# Altium project DARKYDEN.PrjPcb (part 15 of 15)

## Sheet USB2_0_Connector.SchDoc: DARKYDEN_USBC2_0_Connector
size Letter; ApprovedBy: APPROUVÉ PAR; Author: Harold Malbrouck; Organization: Cegep Limoilou; Address1: 1300, 8e Avenue; Address2: Québec, QC; Address3: Canada; Address4: G1J 5L5; Revision: Rev.C; SheetNumber: 21; SheetTotal: 22
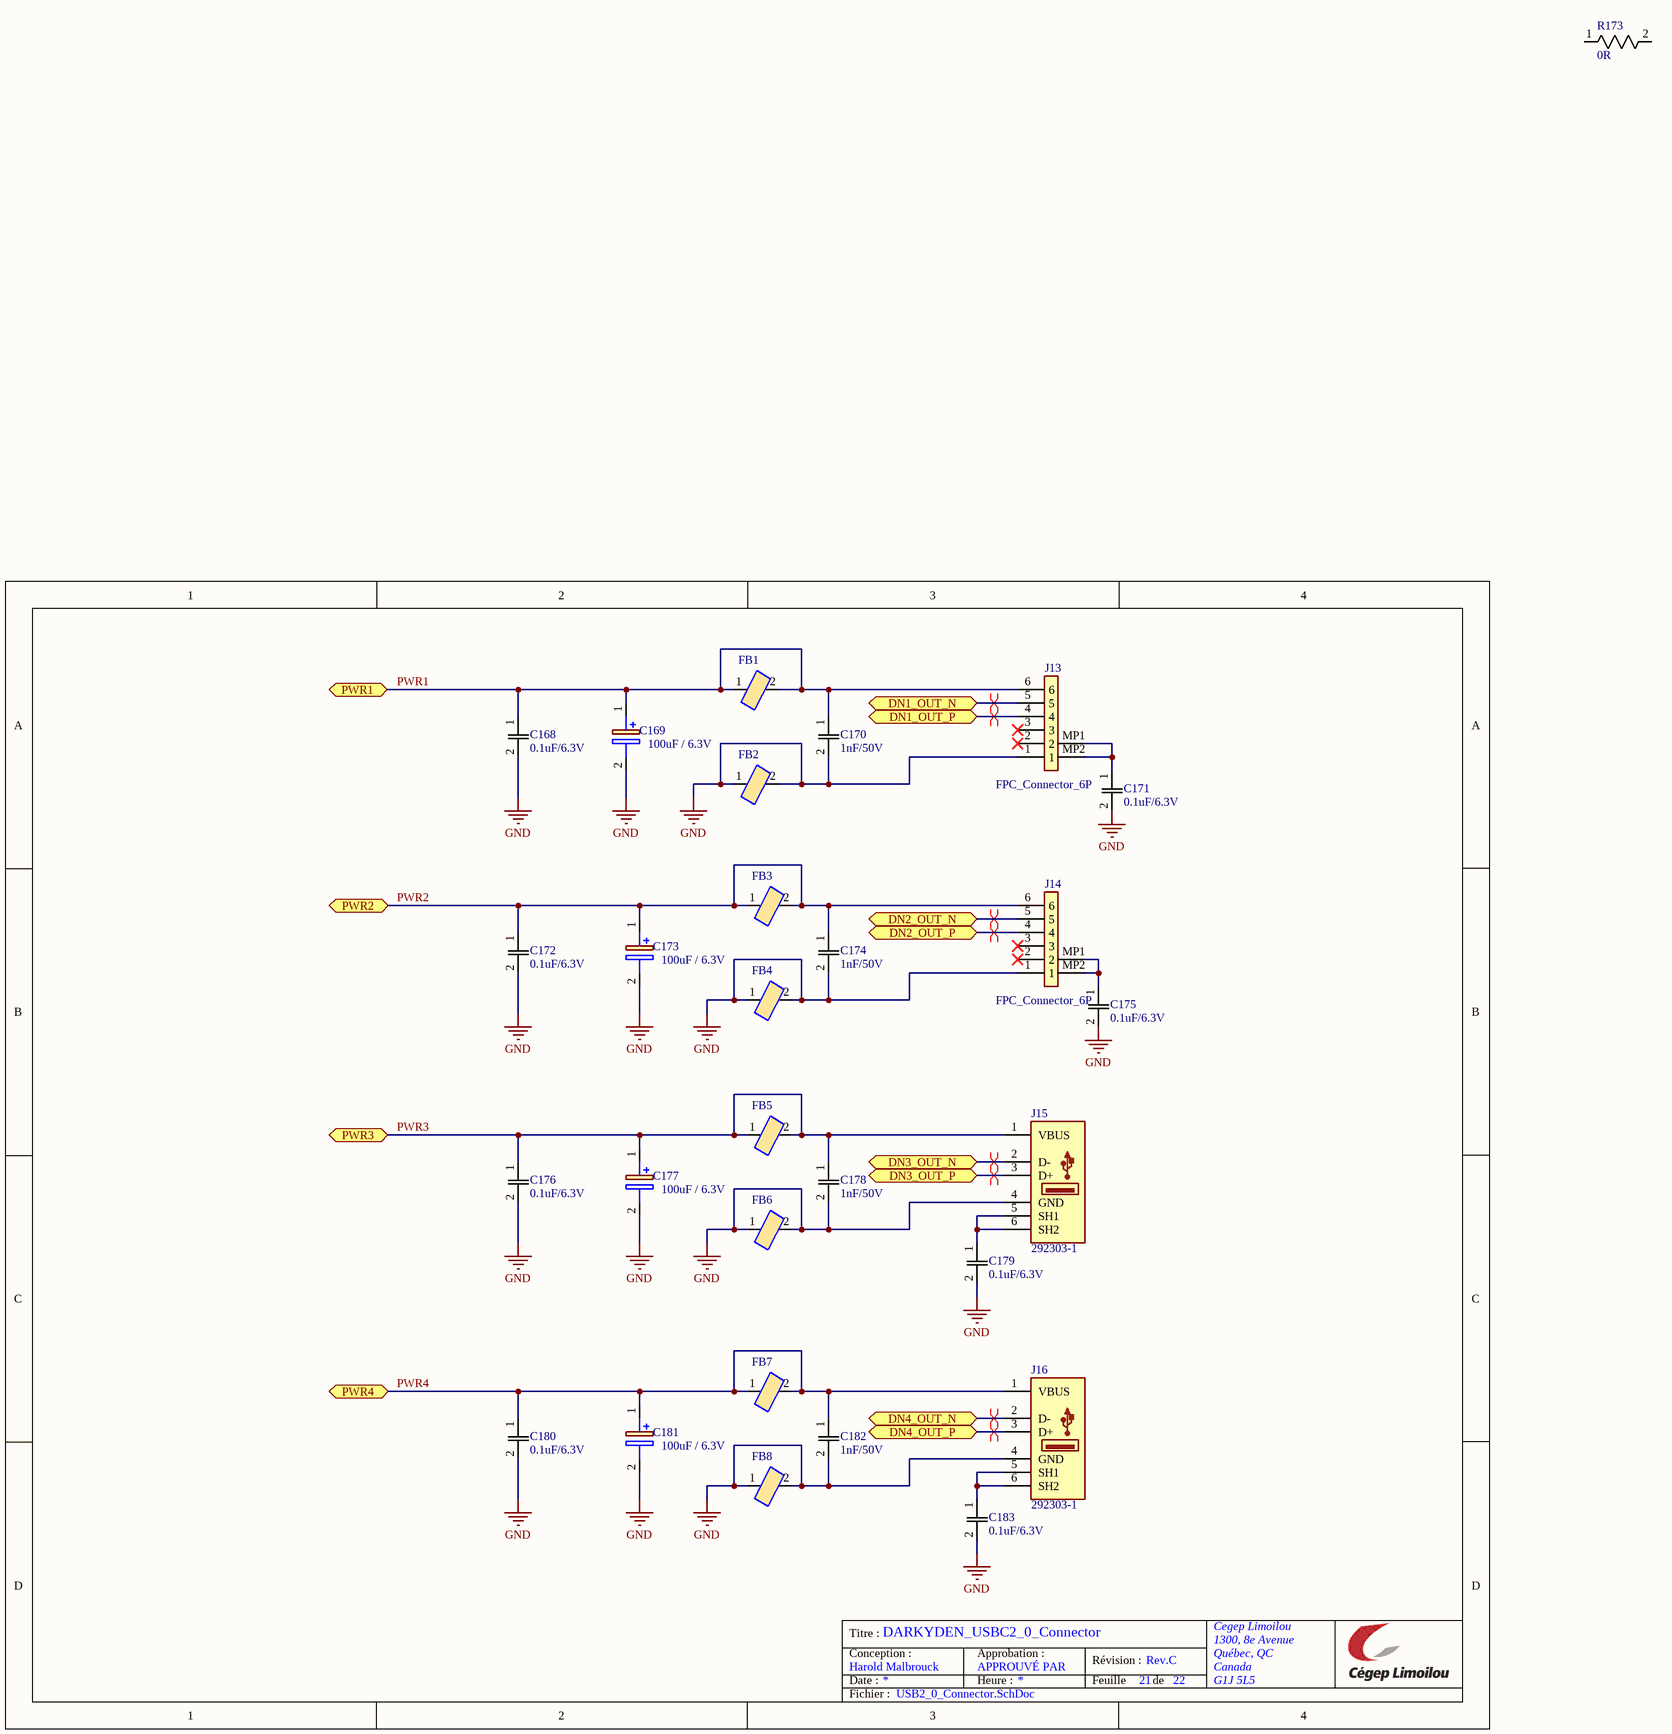
[diagram p20: USB2_0_Connector.SchDoc]

### Parts
C168  0.1uF/6.3V  [C0805]
C169  100uF / 6.3V  [EEE0GA101SR]
C170  1nF/50V  [CAPC2012X88N]
C171  0.1uF/6.3V  [C0805]
C172  0.1uF/6.3V  [C0805]
C173  100uF / 6.3V  [EEE0GA101SR]
C174  1nF/50V  [CAPC2012X88N]
C175  0.1uF/6.3V  [C0805]
C176  0.1uF/6.3V  [C0805]
C177  100uF / 6.3V  [EEE0GA101SR]
C178  1nF/50V  [CAPC2012X88N]
C179  0.1uF/6.3V  [C0805]
C180  0.1uF/6.3V  [C0805]
C181  100uF / 6.3V  [EEE0GA101SR]
C182  1nF/50V  [CAPC2012X88N]
C183  0.1uF/6.3V  [C0805]
FB1  220R / 100MHz  [BLM18SP221SN1B]  (value not drawn)
FB2  220R / 100MHz  [BLM18SP221SN1B]  (value not drawn)
FB3  220R / 100MHz  [BLM18SP221SN1B]  (value not drawn)
FB4  220R / 100MHz  [BLM18SP221SN1B]  (value not drawn)
FB5  220R / 100MHz  [BLM18SP221SN1B]  (value not drawn)
FB6  220R / 100MHz  [BLM18SP221SN1B]  (value not drawn)
FB7  220R / 100MHz  [BLM18SP221SN1B]  (value not drawn)
FB8  220R / 100MHz  [BLM18SP221SN1B]  (value not drawn)
J13  FPC_Connector_6P  [23287026]
J14  FPC_Connector_6P  [23287026]
J15  292303-1  [TECONN-4POS-USB]
J16  292303-1  [TECONN-4POS-USB]
R173  0R  [ERJ3EKF1000V]

### Ports
DN1_OUT_N (bidir, see USB2_0[3C]), DN1_OUT_P (bidir, see USB2_0[3C]), DN2_OUT_N (bidir, see USB2_0[4C]), DN2_OUT_P (bidir, see USB2_0[4C]), DN3_OUT_N (bidir, see USB2_0[2D]), DN3_OUT_P (bidir, see USB2_0[2D]), DN4_OUT_N (bidir, see USB2_0[3D]), DN4_OUT_P (bidir, see USB2_0[3D]), PWR1 (bidir, see USB2_0[2C]), PWR2 (bidir, see USB2_0[3C]), PWR3 (bidir, see USB2_0[1D]), PWR4 (bidir, see USB2_0[3D])

### Nets
GND: C168.2 C169.2(-) C170.2 C171.2 C172.2 C173.2(-) C174.2 C175.2 C176.2 C177.2(-) C178.2 C179.2 C180.2 C181.2(-) C182.2 C183.2 FB2.1 FB2.2 FB4.1 FB4.2 FB6.1 FB6.2 FB8.1 FB8.2 J13.1 J14.1 J15.4(GND) J16.4(GND)  [project net PACK-]
DN1_OUT_N: J13.5 ; port DN1_OUT_N
DN1_OUT_P: J13.4 ; port DN1_OUT_P
DN2_OUT_N: J14.5 ; port DN2_OUT_N
DN2_OUT_P: J14.4 ; port DN2_OUT_P
DN3_OUT_N: J15.2(D-) ; port DN3_OUT_N
DN3_OUT_P: J15.3(D+) ; port DN3_OUT_P
DN4_OUT_N: J16.2(D-) ; port DN4_OUT_N
DN4_OUT_P: J16.3(D+) ; port DN4_OUT_P
PWR1: C168.1 C169.1(+) C170.1 FB1.1 FB1.2 J13.6 ; port PWR1
PWR2: C172.1 C173.1(+) C174.1 FB3.1 FB3.2 J14.6 ; port PWR2
PWR3: C176.1 C177.1(+) C178.1 FB5.1 FB5.2 J15.1(VBUS) ; port PWR3
PWR4: C180.1 C181.1(+) C182.1 FB7.1 FB7.2 J16.1(VBUS) ; port PWR4
NetC171_1: C171.1 J13.MP1 J13.MP2
NetC175_1: C175.1 J14.MP1 J14.MP2
NetC179_1: C179.1 J15.5(SH1) J15.6(SH2)
NetC183_1: C183.1 J16.5(SH1) J16.6(SH2)

Not connected (* = marked no-connect by the designer): J13 2* 3*; J14 2* 3*; R173 1 2

### Layout directives
differential pair: DN1_OUT_N, DN1_OUT_P, DN2_OUT_N, DN2_OUT_P, DN3_OUT_N, DN3_OUT_P, DN4_OUT_N, DN4_OUT_P

### Notes on the sheet
- Titre :
- Conception :
- Date :
- Approbation :
- Heure :
- Révision :
- Feuille
- de
- Fichier :

### Library data of the parts
C168 C171 C172 C175 C176 C179 C180 C183 = C0805C104K9RACTU: 0.1uF 6.3V X7R 10% Pad SMD 0805 125C T/R; Manufacturer_Name: KEMET; Dielectric Material: Ceramic; Material: 4241ConductorMaterial; Value: 100nF; Datasheet Link: https://content.kemet.com/datasheets/KEM_C1002_X7R_SMD.pdf; Height: 1.1mm; Manufacturer_Part_Number: C0805C104K9RACTU; Mouser Part Number: 80-C0805C104K9R; Mouser Price/Stock: https://www.mouser.co.uk/ProductDetail/KEMET/C0805C104K9RACTU?qs=jbCUrP3sAgRYLjBU7s5h8Q%3D%3D; Arrow Part Number: C0805C104K9RACTU; Arrow Price/Stock: https://www.arrow.com/en/products/c0805c104k9ractu/kemet-corporation; Supplier: Digikey; Supplier Part Number: 399-C0805C104K9RACTUCT-ND; Manufacturer: KEMET; Manufacturer Part Number: C0805C104K9RACTU; RoHS: Yes; Category: Ceramic Capacitors; Stock: 68008; Pricing: 1=0.21, 10=0.214, 100=0.1506, 1000=0.11154 (USD); Mounting Technology: Surface Mount; Case/Package: 0805; Case Code (Metric): 2012; Case Code (Imperial): 0805; Min Operating Temperature: -55°C; Max Operating Temperature: 125°C; Package Quantity: 4000; Voltage Rating: 6.3V; Tolerance: 10%; Packaging: Tape and Reel; Voltage Rating (DC): 6.3V; Dielectric: X7R; Termination: SMD/SMT; Series: SMD Comm X7R; Construction: Flat; Length: 2mm; Width: 1.2mm; Thickness: 0.039inch; Depth: 1.25mm; Radiation Hardening: No; RoHS Compliant: Yes; ComponentLink1URL: http://www.farnell.com/datasheets/2746329.pdf?src-supplier=Farnell; ComponentLink1Description: http://www.farnell.com/datasheets/2746329.pdf?src-supplier=Farnell; ComponentLink2URL: http://www.mouser.com/ds/2/212/KEM_C1002_X7R_SMD-1102033.pdf?src-supplier=Mouser; ComponentLink2Description: http://www.mouser.com/ds/2/212/KEM_C1002_X7R_SMD-1102033.pdf?src-supplier=Mouser; ComponentLink3URL: http://datasheet.octopart.com/C0805C104K9RACTU-KEMET-datasheet-157246124.pdf?src-supplier=Avnet; ComponentLink3Description: http://datasheet.octopart.com/C0805C104K9RACTU-KEMET-datasheet-157246124.pdf?src-supplier=Avnet; ComponentLink4URL: http://datasheet.octopart.com/C0805C104K9RACTU-KEMET-datasheet-157246124.pdf?src-supplier=Onlinecomponents.com; ComponentLink4Description: http://datasheet.octopart.com/C0805C104K9RACTU-KEMET-datasheet-157246124.pdf?src-supplier=Onlinecomponents.com; ComponentLink5URL: http://capacitoredge.kemet.com/capedge2/DataSheet?pn=C0805C104K9RACTU&src-supplier=Avnet; ComponentLink5Description: http://capacitoredge.kemet.com/capedge2/DataSheet?pn=C0805C104K9RACTU&src-supplier=Avnet; ComponentLink6URL: http://www.farnell.com/datasheets/2746329.pdf?src-supplier=Newark; ComponentLink6Description: http://www.farnell.com/datasheets/2746329.pdf?src-supplier=Newark; ComponentLink7URL: http://datasheet.octopart.com/C0805C104K9RACTU-KEMET-datasheet-157246124.pdf?src-supplier=Digikey; ComponentLink7Description: http://datasheet.octopart.com/C0805C104K9RACTU-KEMET-datasheet-157246124.pdf?src-supplier=Digikey; ComponentLink8URL: https://api.kemet.com/component-edge/download/datasheet/C0805C104K9RACTU.pdf?src-supplier=Digikey; ComponentLink8Description: https://api.kemet.com/component-edge/download/datasheet/C0805C104K9RACTU.pdf?src-supplier=Digikey; ComponentLink9URL: https://datasheet.octopart.com/C0805C104K9RACTU.-KEMET-datasheet-179056791.pdf?src-supplier=Element14; ComponentLink9Description: https://datasheet.octopart.com/C0805C104K9RACTU.-KEMET-datasheet-179056791.pdf?src-supplier=Element14; ComponentLink10URL: https://datasheet.octopart.com/C0805C104K9RACTU-KEMET-datasheet-137357759.pdf?src-supplier=Farnell; ComponentLink10Description: https://datasheet.octopart.com/C0805C104K9RACTU-KEMET-datasheet-137357759.pdf?src-supplier=Farnell; ComponentLink11URL: http://www.farnell.com/datasheets/2746329.pdf?src-supplier=Element14; ComponentLink11Description: http://www.farnell.com/datasheets/2746329.pdf?src-supplier=Element14; ComponentLink12URL: https://datasheet.octopart.com/C0805C104K9RACTU-KEMET-datasheet-157246124.pdf?src-supplier=TME; ComponentLink12Description: https://datasheet.octopart.com/C0805C104K9RACTU-KEMET-datasheet-157246124.pdf?src-supplier=TME; ComponentLink13URL: http://datasheet.octopart.com/C0805C104K9RACTU-KEMET-datasheet-157246124.pdf?src-supplier=TTI; ComponentLink13Description: http://datasheet.octopart.com/C0805C104K9RACTU-KEMET-datasheet-157246124.pdf?src-supplier=TTI; ComponentLink14URL: http://datasheet.octopart.com/C0805C104K9RACTU-KEMET-datasheet-157246124.pdf?src-supplier=Electro+Sonic; ComponentLink14Description: http://datasheet.octopart.com/C0805C104K9RACTU-KEMET-datasheet-157246124.pdf?src-supplier=Electro+Sonic
C169 C173 C177 C181 = EEE-FPJ101UAR: 100uF 6.3V 20% Cap Aluminum Lytic  SMD 0.36 Ohm 240mA 2000h 105C Automotive T/R; Manufacturer_Name: Panasonic; Material: Aluminium; ESR (Equivalent Series Resistance): 360mR; Life (Hours): 2000Hour; Leakage Current: 6.3uA; Datasheet Link: http://industrial.panasonic.com/cdbs/www-data/pdf/RDE0000/ABA0000C1184.pdf; Height: 6.5mm; Manufacturer_Part_Number: EEE-FPJ101UAR; Mouser Part Number: 667-EEE-FPJ101UAR; Mouser Price/Stock: https://www.mouser.co.uk/ProductDetail/Panasonic/EEE-FPJ101UAR?qs=d1CqaRUMZD%252BxJy4M83vA9g%3D%3D; Arrow Part Number: EEE-FPJ101UAR; Arrow Price/Stock: https://www.arrow.com/en/products/eee-fpj101uar/panasonic?utm_currency=USD&region=europe; Supplier: Digikey; Supplier Part Number: PCE4514CT-ND; Manufacturer: Panasonic; Manufacturer Part Number: EEE-FPJ101UAR; RoHS: Yes; Category: Aluminum Electrolytic Capacitors; Stock: 28785; Pricing: 1=0.56, 10=0.35, 50=0.2602, 100=0.2317, 500=0.18256 (USD); Mounting Technology: Surface Mount,PCB; Case/Package: Radial; Dielectric Material: Aluminium; Min Operating Temperature: -55°C; Max Operating Temperature: 105°C; Value: 100uF; Packaging: Tape and Reel; Voltage Rating (DC): 6.3V; Package Quantity: 1; Termination: SMD/SMT; Series: FP; Ripple Current: 240mA; Tolerance: 20%; Voltage Rating: 6.3V; Ripple Current (AC): 240mA; Voltage: 6.3V; Construction: Cylindrical; Diameter: 5mm; Length: 6.1mm; Lead Pitch: 1.5mm; Height - Seated (Max): 0.228inch; Radiation Hardening: No; Lead Free: Lead Free; RoHS Compliant: Yes; Reach SVHC Compliant: Unknown; ComponentLink1URL: https://datasheet.ciiva.com/11777/0900766b80df09a1-11777260.pdf?src-supplier=Rs; ComponentLink1Description: https://datasheet.ciiva.com/11777/0900766b80df09a1-11777260.pdf?src-supplier=Rs; ComponentLink2URL: https://datasheet.ciiva.com/25614/0900766b80df09a1-25614042.pdf?src-supplier=Rs; ComponentLink2Description: https://datasheet.ciiva.com/25614/0900766b80df09a1-25614042.pdf?src-supplier=Rs; ComponentLink3URL: https://datasheet.ciiva.com/2985/aba0000ce114-2985560.pdf?src-supplier=Avnet; ComponentLink3Description: https://datasheet.ciiva.com/2985/aba0000ce114-2985560.pdf?src-supplier=Avnet; ComponentLink4URL: https://datasheet.ciiva.com/30259/aba0000ce114-30259452.pdf?src-supplier=Onlinecomponents.com; ComponentLink4Description: https://datasheet.ciiva.com/30259/aba0000ce114-30259452.pdf?src-supplier=Onlinecomponents.com; ComponentLink5URL: https://datasheet.ciiva.com/14597/70068195-14597061.pdf?src-supplier=Allied+Electronics; ComponentLink5Description: https://datasheet.ciiva.com/14597/70068195-14597061.pdf?src-supplier=Allied+Electronics; ComponentLink6URL: https://datasheet.ciiva.com/14606/70068195-14606383.pdf?src-supplier=Allied+Electronics; ComponentLink6Description: https://datasheet.ciiva.com/14606/70068195-14606383.pdf?src-supplier=Allied+Electronics; ComponentLink7URL: https://datasheet.ciiva.com/48523/fp-eng-tds-48523719.pdf?src-supplier=Distrelec; ComponentLink7Description: https://datasheet.ciiva.com/48523/fp-eng-tds-48523719.pdf?src-supplier=Distrelec; ComponentLink8URL: https://datasheet.ciiva.com/46391/370232-46391160.pdf?src-supplier=Element14; ComponentLink8Description: https://datasheet.ciiva.com/46391/370232-46391160.pdf?src-supplier=Element14; ComponentLink9URL: https://datasheet.ciiva.com/46398/370232-46398005.pdf?src-supplier=Element14; ComponentLink9Description: https://datasheet.ciiva.com/46398/370232-46398005.pdf?src-supplier=Element14
C170 C174 C178 C182 = C0805C102K5RAC-TU: 1000 pF ±10% 50V Ceramic Capacitor X7R 0805 (2012 Metric); Manufacturer_Name: KEMET; Datasheet Link: https://componentsearchengine.com/Datasheets/2/C0805C102K5RAC-TU.pdf; Height: 0.88mm; Manufacturer_Part_Number: C0805C102K5RAC-TU
FB1-FB8 = BLM18EG221SN1D: Ferrite Beads Multi-Layer 220Ohm 25% 100MHz 2A 50mOhm DCR 0603 Paper T/R; Manufacturer_Name: Murata Electronics; Manufacturer: Murata; Material: Steel,Ferrite; Value: 50mR; Number of Lines: 1; Number of Circuits: 1NUMBER; Datasheet Link: http://www.murata.com/~/media/webrenewal/support/library/catalog/products/emc/emifil/c31e.ashx?la=en-gb; Height: 0.95mm; Manufacturer_Part_Number: BLM18EG221SN1D; Mouser Part Number: 81-BLM18EG221SN1D; Mouser Price/Stock: https://www.mouser.co.uk/ProductDetail/Murata-Electronics/BLM18EG221SN1D?qs=uSeJpk%2F8In2DDeSj2a4KGA%3D%3D; Arrow Part Number: BLM18EG221SN1D; Arrow Price/Stock: https://www.arrow.com/en/products/blm18eg221sn1d/murata-manufacturing?utm_currency=USD&region=nac; Supplier: Digikey; Supplier Part Number: 490-3992-1-ND; Manufacturer Part Number: BLM18EG221SN1D; RoHS: Yes; Category: Ferrite Beads and Chips; Stock: 133283; Pricing: 1=0.24, 10=0.167, 25=0.1444, 50=0.1292, 100=0.1154, 250=0.09864, 500=0.08708, 1000=0.07636 (USD); Case/Package: 0603; Pins: 2; Core Material: Ferrite; Case Code (Metric): 1608; Case Code (Imperial): 0603; Min Operating Temperature: -55°C; Max Operating Temperature: 125°C; Tolerance: 25%; Impedance: 220R; Package Quantity: 1; Packaging: Tape and Reel; Current Rating: 2A; Max Current Rating: 2A; DC Resistance (DCR): 50mR; Max DC Current: 2A; Termination: SMD/SMT; Test Frequency: 100MHz; DC Current: 2A; Series: BLM18E; DC Resistance-Max: 50mR; RMS Current (Irms): 2A; ESR: 50mR; Frequency: 100MHz; Length: 1.6mm; Width: 0.8mm; Depth: 0.8mm; Radiation Hardening: No; Reach SVHC Compliant: No; Military Standard: Not; Lead Free: Lead Free; RoHS Compliant: Yes; ComponentLink1URL: https://datasheet.ciiva.com/11799/0900766b811b5866-11799010.pdf?src-supplier=Rs; ComponentLink1Description: https://datasheet.ciiva.com/11799/0900766b811b5866-11799010.pdf?src-supplier=Rs; ComponentLink2URL: https://datasheet.ciiva.com/41449/001171699-da-01-en-chip-drossel0603-220r-2000ma-1-6x0-8mm-41449376.pdf?src-supplier=Conrad; ComponentLink2Description: https://datasheet.ciiva.com/41449/001171699-da-01-en-chip-drossel0603-220r-2000ma-1-6x0-8mm-41449376.pdf?src-supplier=Conrad; ComponentLink3URL: https://datasheet.ciiva.com/41449/001172265-da-01-en-drossel-0603-220r-1-6x0-8mm-4000st-41449579.pdf?src-supplier=Conrad; ComponentLink3Description: https://datasheet.ciiva.com/41449/001172265-da-01-en-drossel-0603-220r-1-6x0-8mm-4000st-41449579.pdf?src-supplier=Conrad; ComponentLink4URL: https://datasheet.ciiva.com/1012/l0110s0101blm18e-1012872.pdf?src-supplier=Digikey; ComponentLink4Description: https://datasheet.ciiva.com/1012/l0110s0101blm18e-1012872.pdf?src-supplier=Digikey; ComponentLink5URL: https://datasheet.ciiva.com/1012/l0110s0101blm18e-1012873.pdf?src-supplier=Digikey; ComponentLink5Description: https://datasheet.ciiva.com/1012/l0110s0101blm18e-1012873.pdf?src-supplier=Digikey; ComponentLink6URL: https://datasheet.ciiva.com/1012/l0110s0101blm18e-1012874.pdf?src-supplier=Digikey; ComponentLink6Description: https://datasheet.ciiva.com/1012/l0110s0101blm18e-1012874.pdf?src-supplier=Digikey; ComponentLink7URL: https://datasheet.ciiva.com/14122/blm-series-eng-tds-14122908.pdf?src-supplier=Distrelec; ComponentLink7Description: https://datasheet.ciiva.com/14122/blm-series-eng-tds-14122908.pdf?src-supplier=Distrelec; ComponentLink8URL: https://datasheet.ciiva.com/1467/5169-1467157.pdf?src-supplier=Element14; ComponentLink8Description: https://datasheet.ciiva.com/1467/5169-1467157.pdf?src-supplier=Element14; ComponentLink9URL: https://datasheet.ciiva.com/1467/5169-1467158.pdf?src-supplier=Element14; ComponentLink9Description: https://datasheet.ciiva.com/1467/5169-1467158.pdf?src-supplier=Element14; ComponentLink10URL: https://datasheet.ciiva.com/8510/l0110s0101blm18e-8510140.pdf?src-supplier=Avnet; ComponentLink10Description: https://datasheet.ciiva.com/8510/l0110s0101blm18e-8510140.pdf?src-supplier=Avnet; ComponentLink11URL: https://datasheet.ciiva.com/16419/l0110s0101blm18e-16419148.pdf?src-supplier=Future+Electronics; ComponentLink11Description: https://datasheet.ciiva.com/16419/l0110s0101blm18e-16419148.pdf?src-supplier=Future+Electronics
J13 J14 = 2328702-6: FPC Connector; 0.5mm pitch dual contact back flip FPC, 6pos | TE Connectivity 2328702-6; Actuator Material: Thermoplastic; Actuator Color: Black; Number of Positions: 6; Voltage Rating: 50V; Current Rating: 500mA; Value: 7.6pF; Datasheet Link: https://www.te.com/commerce/DocumentDelivery/DDEController?Action=srchrtrv&DocNm=1-1773959-7-FPC-Connectors-CN&DocType=Data%20Sheet&DocLang=Chinese (Simplified)&PartCntxt=2328702-6&DocFormat=pdf; Height: 1.1mm; Manufacturer_Name: TE Connectivity; Manufacturer_Part_Number: 2328702-6; Mouser Part Number: 571-2328702-6; Mouser Price/Stock: https://www.mouser.co.uk/ProductDetail/TE-Connectivity/2328702-6?qs=w%2Fv1CP2dgqrAQsCHQ2ClBQ%3D%3D; Arrow Part Number: 2328702-6; Arrow Price/Stock: https://www.arrow.com/en/products/2328702-6/te-connectivity?utm_currency=USD&region=nac; Supplier: Digikey; Supplier Part Number: A141388CT-ND; Manufacturer: TE Connectivity; Manufacturer Part Number: 2328702-6; RoHS: Yes; Category: FFC / FPC; Stock: 48490; Pricing: 1=0.19, 10=0.162, 25=0.1512, 50=0.144, 100=0.1372, 250=0.12856, 500=0.12242, 1000=0.11657 (USD); Mounting Technology: Surface Mount; Case/Package: 0402; Contact Material: Copper Alloy; Contact Plating: Gold; Housing Material: Thermoplastic; Housing Color: Natural; Min Operating Temperature: -40°C; Max Operating Temperature: 85°C; Packaging: Cut Tape; Termination: Solder; Series: -; Ratings: AEC-Q200; Flammability Rating: UL94 V-0; ComponentLink1URL: https://www.te.com/commerce/DocumentDelivery/DDEController?Action=srchrtrv&amp;DocNm=2328702&amp;DocType=Customer+Drawing&amp;DocLang=English&src-supplier=Digikey; ComponentLink1Description: https://www.te.com/commerce/DocumentDelivery/DDEController?Action=srchrtrv&amp;DocNm=2328702&amp;DocType=Customer+Drawing&amp;DocLang=English&src-supplier=Digikey; ComponentLink2URL: https://www.te.com/commerce/DocumentDelivery/DDEController?Action=srchrtrv&DocNm=2328702&DocType=Customer+Drawing&DocLang=English&src-supplier=Digikey; ComponentLink2Description: https://www.te.com/commerce/DocumentDelivery/DDEController?Action=srchrtrv&DocNm=2328702&DocType=Customer+Drawing&DocLang=English&src-supplier=Digikey; ComponentLink3URL: https://datasheet.octopart.com/2328702-6-TE-Connectivity-datasheet-137167967.pdf?src-supplier=Electro+Sonic; ComponentLink3Description: https://datasheet.octopart.com/2328702-6-TE-Connectivity-datasheet-137167967.pdf?src-supplier=Electro+Sonic
J15 J16 = 292303-1: USB-A (USB TYPE-A) USB 2.0 Receptacle Connector 4 Position Through Hole, Right Angle; Manufacturer_Name: TE Connectivity; Datasheet Link: https://datasheet.datasheetarchive.com/originals/distributors/Datasheets_SAMA/3e4c4de204b167d1a9250e6de251b7b8.pdf; Manufacturer_Part_Number: 292303-1; Mouser Part Number: 571-292303-1; Mouser Price/Stock: https://www.mouser.co.uk/ProductDetail/TE-Connectivity/292303-1?qs=G%2F5vCLrg9vx2OsUPTgR%2F%252BQ%3D%3D; Arrow Part Number: 292303-1; Arrow Price/Stock: https://www.arrow.com/en/products/292303-1/te-connectivity?region=europe
R173 = ERJ-3GEY0R00V: Zero Ohm Resistor, Jumper, 0603 [1608 Metric], Thick Film, 100 mW, 1 A, Surface Mount; Manufacturer_Name: Panasonic; Power Rating: 100mW; Voltage Rating: 75V; Tolerance: 0%; Temperature Coefficient: 200ppm/°C; Datasheet Link: http://docs-europe.electrocomponents.com/webdocs/13ba/0900766b813ba21b.pdf; Height: 0.55mm; Manufacturer_Part_Number: ERJ-3GEY0R00V; Mouser Part Number: 667-ERJ-3GEY0R00V; Mouser Price/Stock: https://www.mouser.co.uk/ProductDetail/Panasonic/ERJ-3GEY0R00V?qs=66DK8nO8gJALIOqOWgiVwg%3D%3D; Arrow Part Number: ERJ-3GEY0R00V; Arrow Price/Stock: https://www.arrow.com/en/products/erj3gey0r00v/panasonic?region=europe; Supplier: Digikey; Supplier Part Number: P0.0GCT-ND; Manufacturer: Panasonic; Manufacturer Part Number: ERJ-3GEY0R00V; RoHS: Yes; Category: Chip SMD Resistors; Stock: 766631; Pricing: 1=0.1, 10=0.02, 25=0.0164, 50=0.0144, 100=0.0126, 250=0.0106, 500=0.00936, 1000=0.0083 (USD); Mounting Technology: Surface Mount; Case/Package: 0603; Case Code (Metric): 1608; Case Code (Imperial): 0603; Contact Plating: Tin; Min Operating Temperature: -55°C; Max Operating Temperature: 155°C; Packaging: Tape and Reel; Package Quantity: 5000; Value: 0R; Resistor Type: Thick Film; Number of Terminations: 2; Termination: SMD/SMT; Max Power Dissipation: 100mW; Features: Automotive AEC-Q200; Series: ERJ; Construction: Rectangular; Technology: THICK FILM; Length: 1.6mm; Width: 0.8mm; Depth: 0.8mm; Ratings: AEC-Q200; Radiation Hardening: No; Reach SVHC Compliant: No; Military Standard: Not; RoHS Compliant: Yes; Lead Free: 5697LeadFree; ComponentLink1URL: https://datasheet.ciiva.com/11808/0900766b80f806dd-11808207.pdf?src-supplier=Rs; ComponentLink1Description: https://datasheet.ciiva.com/11808/0900766b80f806dd-11808207.pdf?src-supplier=Rs; ComponentLink2URL: https://datasheet.ciiva.com/27055/1935748-27055113.pdf?src-supplier=Jameco; ComponentLink2Description: https://datasheet.ciiva.com/27055/1935748-27055113.pdf?src-supplier=Jameco; ComponentLink3URL: https://datasheet.ciiva.com/5959/1678796-5959707.pdf?src-supplier=Farnell; ComponentLink3Description: https://datasheet.ciiva.com/5959/1678796-5959707.pdf?src-supplier=Farnell; ComponentLink4URL: https://datasheet.ciiva.com/43460/1678796-43460647.pdf?src-supplier=Farnell; ComponentLink4Description: https://datasheet.ciiva.com/43460/1678796-43460647.pdf?src-supplier=Farnell; ComponentLink5URL: https://datasheet.ciiva.com/48532/aoa0000ce1-48532165.pdf?src-supplier=Avnet; ComponentLink5Description: https://datasheet.ciiva.com/48532/aoa0000ce1-48532165.pdf?src-supplier=Avnet; ComponentLink6URL: https://datasheet.ciiva.com/28695/1678796-28695833.pdf?src-supplier=Element14; ComponentLink6Description: https://datasheet.ciiva.com/28695/1678796-28695833.pdf?src-supplier=Element14; ComponentLink7URL: https://datasheet.ciiva.com/16834/aoa0000ce1-16834828.pdf?src-supplier=Future+Electronics; ComponentLink7Description: https://datasheet.ciiva.com/16834/aoa0000ce1-16834828.pdf?src-supplier=Future+Electronics; ComponentLink8URL: https://datasheet.ciiva.com/16758/70255313-16758527.pdf?src-supplier=Allied+Electronics; ComponentLink8Description: https://datasheet.ciiva.com/16758/70255313-16758527.pdf?src-supplier=Allied+Electronics; ComponentLink9URL: https://datasheet.ciiva.com/30199/4aoa0000ce1-30199822.pdf?src-supplier=Onlinecomponents.com; ComponentLink9Description: https://datasheet.ciiva.com/30199/4aoa0000ce1-30199822.pdf?src-supplier=Onlinecomponents.com; ComponentLink10URL: https://datasheet.ciiva.com/46377/1678796-46377868.pdf?src-supplier=Element14; ComponentLink10Description: https://datasheet.ciiva.com/46377/1678796-46377868.pdf?src-supplier=Element14; ComponentLink11URL: https://datasheet.ciiva.com/9198/aoa0000ce1-9198975.pdf?src-supplier=Avnet; ComponentLink11Description: https://datasheet.ciiva.com/9198/aoa0000ce1-9198975.pdf?src-supplier=Avnet

## Sheet CM3588.SchDoc: DARKYDEN_CONNECTEUR_1
size Letter; ApprovedBy: APPROUVÉ PAR; Author: Harold Malbrouck; Organization: Cegep Limoilou; Address1: 1300, 8e Avenue; Address2: Québec, QC; Address3: Canada; Address4: G1J 5L5; Revision: Rev.B; SheetNumber: 22; SheetTotal: 22
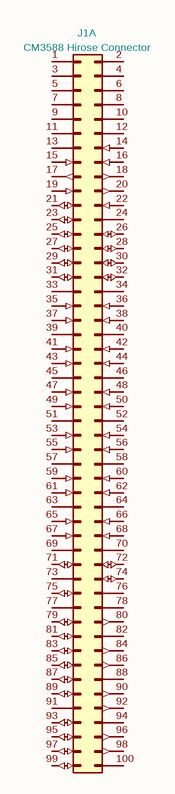
[diagram p21: CM3588.SchDoc]

### Parts
J1  CM3588 Hirose Connector  [CM3588]  (part A of 4)

### Nets

Not connected (* = marked no-connect by the designer): J1 1(VDD_DCIN) 2(VDD_DCIN) 3(VDD_DCIN) 4(VDD_DCIN) 5(VDD_DCIN) 6(VDD_DCIN) 7(VDD_DCIN) 8(VDD_DCIN) 9(VDD_DCIN) 10(VDD_DCIN) 11(GND) 12(GND) 13(GND) 14(SARADC_VIN6_HW_ID2) 15(BOOT_SARADC_IN0) 16(RESET_L) 17(PWRON_L) 18(VDC_MODE) 19(PMIC_EXT_EN_OUT) 20(UART2_TX_M0_DEBUG) 21(GPIO2_C0) 22(UART2_RX_M0_DEBUG) 23(GPIO2_C1/MIPI_CAM2_RESET_L) 24(GND) 25(GPIO2_C2/MIPI_CAM2_PDN_L) 26(GPIO4_C2) 27(GPIO2_C3) 28(GPIO4_C3) 29(GPIO2_C4) 30(GPIO4_C4) 31(GPIO4_C6) 32(GPIO4_C5) 33(GND) 34(GND) 35(MIPI_CSI1_RX_CLK1P) 36(MIPI_CSI0_RX_CLK1P) 37(MIPI_CSI1_RX_CLK1N) 38(MIPI_CSI0_RX_CLK1N) 39(GND) 40(GND) 41(MIPI_CSI1_RX_D3P) 42(MIPI_CSI0_RX_D3P) 43(MIPI_CSI1_RX_D3N) 44(MIPI_CSI0_RX_D3N) 45(GND) 46(GND) 47(MIPI_CSI1_RX_D2P) 48(MIPI_CSI0_RX_D2P) 49(MIPI_CSI1_RX_D2N) 50(MIPI_CSI0_RX_D2N) 51(GND) 52(GND) 53(MIPI_CSI1_RX_CLK0P) 54(MIPI_CSI0_RX_CLK0P) 55(MIPI_CSI1_RX_CLK0N) 56(MIPI_CSI0_RX_CLK0N) 57(GND) 58(GND) 59(MIPI_CSI1_RX_D1P) 60(MIPI_CSI0_RX_D1P) 61(MIPI_CSI1_RX_D1N) 62(MIPI_CSI0_RX_D1N) 63(GND) 64(GND) 65(MIPI_CSI1_RX_D0P) 66(MIPI_CSI0_RX_D0P) 67(MIPI_CSI1_RX_D0N) 68(MIPI_CSI0_RX_D0N) 69(GND) 70(GND) 71(GPIO1_B6) 72(LED3_25GLAN_25GLED) 73(GND) 74(LED2_25GLAN_1GLED) 75(GPIO1_B7) 76(GND) 77(GND) 78(P25G_MDIP0) 79(GPIO2_A6) 80(P25G_MDIN0) 81(GPIO2_A7) 82(GND) 83(GPIO2_B0) 84(P25G_MDIP1) 85(GPIO2_B1_GPIO,) 86(P25G_MDIN1) 87(GPIO2_B2) 88(GND) 89(GPIO2_B3) 90(P25G_MDIP2) 91(GND) 92(P25G_MDIN2) 93(GPIO2_B4) 94(GND) 95(GPIO2_B5) 96(P25G_MDIP3) 97(GPIO2_B6) 98(P25G_MDIN3) 99(GPIO2_B7) 100(GND)

### Notes on the sheet
- Titre :
- Conception :
- Date :
- Approbation :
- Heure :
- Révision :
- Feuille
- de
- Fichier :

### Library data of the parts
J1 = CM3588: LCSC: C597931; Footprint: Library:CM3588; Value: CM3588 Hirose Connector

## Nets that join several sheets
+1V8: SDCARD (R49.2), Power (C67.2 IC7.5), SystemCTL (5 pins)
+3V3_NVME: NVME (11 pins), POWER_PCie (7 pins)
+3V3_SD_SO: SDCARD (5 pins), CONNECTEUR_4 (CON4.58)
+3V3_WIFI: POWER_PCie (7 pins), WIFI (J5.2 J5.4 J5.72 J5.74)
+5V: USBC_A (7 pins), USBC_B (7 pins), HDMI (8 pins), NVME (C26.2 U16.1), Power (7 pins), USB2_0 (IC18.5 IC18.7 IC19.7 IC20.7)
P3V3: POWERSYSTEM (C87.2 U25.38), BATTERY_GESTION (R107.2 R118.2 R119.2), P3V3_PP5V_GESTION (C152.2 IC16.5)
PACK-: USBC_A (39 pins), USBC_B (39 pins), ETHERNET (8 pins), HDMI (27 pins), NVME (39 pins), POWER_PCie (18 pins), SDCARD (11 pins), Power (24 pins), SystemCTL (15 pins), WIFI (13 pins), CONNECTEUR_1 (26 pins), CONNECTEUR_2 (32 pins), CONNECTEUR_3 (24 pins), CONNECTEUR_4 (25 pins), eDP (18 pins), POWERSYSTEM (54 pins), BATTERY_GESTION (30 pins), 12V_FROM_BATTERY (19 pins), P3V3_PP5V_GESTION (17 pins), USB2_0 (32 pins), USB2_0_Connector (28 pins)
VCC_SYS: BATTERY_GESTION (IC13.1 R121.2), 12V_FROM_BATTERY (10 pins), P3V3_PP5V_GESTION (5 pins)
VDD33A: USBC_A (C9.2 U3.4), USBC_B (C17.2 R13.2 U9.4), ETHERNET (R14.2 R15.2), HDMI (6 pins), NVME (R18.2 R22.2), Power (9 pins), SystemCTL (R77.2), eDP (C21.2 U13.1), USB2_0 (7 pins)
Vout: POWER_PCie (R93.1 R94.1 R98.1 R99.1), Power (R79.1 R80.1 R84.1 R85.1), CONNECTEUR_1 (R6.2 R7.2), eDP (eDP1.10 eDP1.11 eDP1.12), 12V_FROM_BATTERY (9 pins)
BOOT_SARADC_IN0: SystemCTL (C43.1 R72.1), CONNECTEUR_1 (CON1.15)
DN1_OUT_N: USB2_0 (BR2.4 L20.3), USB2_0_Connector (J13.5)
DN1_OUT_P: USB2_0 (BR2.2 L20.4), USB2_0_Connector (J13.4)
DN2_OUT_N: USB2_0 (BR3.4 L21.3), USB2_0_Connector (J14.5)
DN2_OUT_P: USB2_0 (BR3.2 L21.4), USB2_0_Connector (J14.4)
DN3_OUT_N: USB2_0 (BR5.4 L23.3), USB2_0_Connector (J15.2)
DN3_OUT_P: USB2_0 (BR5.2 L23.4), USB2_0_Connector (J15.3)
DN4_OUT_N: USB2_0 (BR4.4 L22.3), USB2_0_Connector (J16.2)
DN4_OUT_P: USB2_0 (BR4.2 L22.4), USB2_0_Connector (J16.3)
EN: USBC_A (R1.2 U2.4), CONNECTEUR_3 (CON3.39)
EN: USBC_B (R10.2 U8.4), CONNECTEUR_4 (CON4.90)
GPIO0_A4/SDMMC_DET_L: SDCARD (R49.1 R50.1), CONNECTEUR_4 (CON4.70)
GPIO0_B2: WIFI (J5.21), CONNECTEUR_3 (CON3.47)
GPIO0_C4/UART0_RX_M0: WIFI (R41.1), CONNECTEUR_3 (CON3.70)
GPIO0_C5/UART0_TX_M0/PWM4_M0: WIFI (J5.20), CONNECTEUR_3 (CON3.72)
GPIO0_D3/CC_INT_L: USBC_A (U3.5), CONNECTEUR_3 (CON3.64)
GPIO0_D5: USBC_B (R13.1 U9.5), CONNECTEUR_3 (CON3.68)
GPIO1_A0/UART6_RX_M1: WIFI (J5.22), CONNECTEUR_3 (CON3.73)
GPIO1_A1/UART6_TX_M1: WIFI (J5.32), CONNECTEUR_3 (CON3.75)
GPIO1_A2/I2C4_SDA_M3_TP: WIFI (J5.36), CONNECTEUR_3 (CON3.77)
GPIO1_A3/I2C4_SCL_M3_TP: WIFI (J5.34), CONNECTEUR_3 (CON3.79)
GPIO1_A4: SystemCTL (IC4.2), CONNECTEUR_3 (CON3.81)
GPIO2_A6: WIFI (J5.13), CONNECTEUR_1 (CON1.79)
GPIO2_A7: WIFI (J5.15), CONNECTEUR_1 (CON1.81)
GPIO2_B0: WIFI (J5.17), CONNECTEUR_1 (CON1.83)
GPIO2_B1: WIFI (J5.19), CONNECTEUR_1 (CON1.85)
GPIO2_B2: WIFI (J5.11), CONNECTEUR_1 (CON1.87)
GPIO2_B3: WIFI (J5.9), CONNECTEUR_1 (CON1.89)
GPIO2_B7: WIFI (J5.8), CONNECTEUR_1 (CON1.99)
GPIO2_C0: WIFI (J5.10), CONNECTEUR_1 (CON1.21)
GPIO2_C3: WIFI (R42.2), CONNECTEUR_1 (CON1.27)
GPIO3_A0/SPI4_MISO_M1/PWM10_M0: SystemCTL (IC4.3), CONNECTEUR_4 (CON4.87)
GPIO3_A1/SPI4_MOSI_M1: SystemCTL (IC4.5), CONNECTEUR_4 (CON4.89)
GPIO3_A2/SPI4_CLK_M1/UART8_TX_M1: SystemCTL (IC4.6 R76.1), CONNECTEUR_4 (CON4.91)
GPIO3_A3/SPI4_CS0_M1/UART8_RX_M1: SystemCTL (IC4.7 R75.1), CONNECTEUR_4 (CON4.93)
GPIO3_A5: SystemCTL (IC4.1), CONNECTEUR_4 (CON4.97)
GPIO3_A6/LCD_RST: WIFI (J5.42), CONNECTEUR_4 (CON4.99)
GPIO3_A7: CONNECTEUR_4 (CON4.100), eDP (U13.3)
GPIO3_B0/PWM9_M0: CONNECTEUR_4 (CON4.82), BATTERY_GESTION (IC13.6 R119.1)
GPIO3_B7: CONNECTEUR_4 (CON4.98), eDP (eDP1.16)
GPIO3_C7/I2C5_SCL_M0_TP: CONNECTEUR_4 (CON4.81), BATTERY_GESTION (IC13.4 R107.1)
GPIO3_D0/I2C5_SDA_M0_TP: CONNECTEUR_4 (CON4.79), BATTERY_GESTION (IC13.5 R118.1)
GPIO3_D5/PWM11_M3/LCD_2_BL: WIFI (J5.54 J5.70), CONNECTEUR_4 (CON4.85)
GPIO4_A0/TP_2_INT_L: WIFI (J5.53), CONNECTEUR_3 (CON3.51)
GPIO4_A1/TP_2_RST_L: WIFI (J5.55), CONNECTEUR_3 (CON3.53)
GPIO4_A2: WIFI (J5.52), CONNECTEUR_3 (CON3.55)
GPIO4_B4/PCIE30X4_CLKREQn_M1_L: NVME (R20.2), CONNECTEUR_3 (CON3.65)
GPIO4_B5/PCIE30X4_WAKEn_M1_L: NVME (R21.2), CONNECTEUR_3 (CON3.67)
GPIO4_B6/PCIE30X4_PERSTn_M1_L: NVME (R19.2), CONNECTEUR_3 (CON3.69)
GPIO4_C3: WIFI (R43.2), CONNECTEUR_1 (CON1.28)
GPIO4_C4/MIPI_CAM1_RESET_L: WIFI (J5.56), CONNECTEUR_1 (CON1.30)
HDMI0_TX0_N: HDMI (L9.3), CONNECTEUR_4 (CON4.47)
HDMI0_TX0_P: HDMI (L9.4), CONNECTEUR_4 (CON4.45)
HDMI0_TX1_N: HDMI (L8.3), CONNECTEUR_4 (CON4.41)
HDMI0_TX1_P: HDMI (L8.4), CONNECTEUR_4 (CON4.39)
HDMI0_TX2_N: HDMI (L7.3), CONNECTEUR_4 (CON4.35)
HDMI0_TX2_P: HDMI (L7.4), CONNECTEUR_4 (CON4.33)
HDMI0_TX3_N: HDMI (L10.3), CONNECTEUR_4 (CON4.53)
HDMI0_TX3_P: HDMI (L10.4), CONNECTEUR_4 (CON4.51)
HDMI0_TX_ON_H: HDMI (8 pins), CONNECTEUR_4 (CON4.69)
HDMI0_TX_SBD_N: HDMI (J8.19 R54.1 U21.5 U21.6), CONNECTEUR_4 (CON4.59)
HDMI0_TX_SBD_P: HDMI (J8.14 U21.4 U21.7), CONNECTEUR_4 (CON4.57)
HDMI1_TX0_N: CONNECTEUR_4 (CON4.17), eDP (eDP1.29)
HDMI1_TX0_P: CONNECTEUR_4 (CON4.15), eDP (eDP1.28)
HDMI1_TX1_N: CONNECTEUR_4 (CON4.11), eDP (eDP1.32)
HDMI1_TX1_P: CONNECTEUR_4 (CON4.9), eDP (eDP1.31)
HDMI1_TX2_N: CONNECTEUR_4 (CON4.5), eDP (eDP1.35)
HDMI1_TX2_P: CONNECTEUR_4 (CON4.3), eDP (eDP1.34)
HDMI1_TX3_N: CONNECTEUR_4 (CON4.23), eDP (eDP1.38)
HDMI1_TX3_P: CONNECTEUR_4 (CON4.21), eDP (eDP1.37)
HDMI1_TX_SBD_N: CONNECTEUR_4 (CON4.29), eDP (eDP1.25)
HDMI1_TX_SBD_P: CONNECTEUR_4 (CON4.27), eDP (eDP1.26)
HDMITX0_CEC_M0: HDMI (Q3.2 R60.1), CONNECTEUR_4 (CON4.67)
HDMITX0_HPDIN_M0: HDMI (Q4.3 R51.1), CONNECTEUR_3 (CON3.95)
HDMITX0_SCL_M0: HDMI (Q1.2 R55.1), CONNECTEUR_4 (CON4.63)
HDMITX0_SDA_M0: HDMI (R57.1), CONNECTEUR_4 (CON4.65)
LED2_25GLAN_1GLED: ETHERNET (R16.1), CONNECTEUR_1 (CON1.74)
LED3_25GLAN_25GLED: ETHERNET (R17.1), CONNECTEUR_1 (CON1.72)
MDIP0_N: ETHERNET (L3.2), CONNECTEUR_1 (CON1.80)
MDIP0_P: ETHERNET (L3.1), CONNECTEUR_1 (CON1.78)
MDIP1_N: ETHERNET (L4.2), CONNECTEUR_1 (CON1.86)
MDIP1_P: ETHERNET (L4.1), CONNECTEUR_1 (CON1.84)
MDIP2_N: ETHERNET (L5.2), CONNECTEUR_1 (CON1.92)
MDIP2_P: ETHERNET (L5.1), CONNECTEUR_1 (CON1.90)
MDIP3_N: ETHERNET (L6.2), CONNECTEUR_1 (CON1.98)
MDIP3_P: ETHERNET (L6.1), CONNECTEUR_1 (CON1.96)
PCIE20_1_REFCLK_N: WIFI (J5.49), CONNECTEUR_3 (CON3.17)
PCIE20_1_REFCLK_P: WIFI (J5.47), CONNECTEUR_3 (CON3.15)
PCIE20_1_RX_P: WIFI (J5.41 J5.43), CONNECTEUR_3 (CON3.9)
PCIE20_1_TX_N: WIFI (J5.37), CONNECTEUR_3 (CON3.5)
PCIE20_1_TX_P: WIFI (J5.35), CONNECTEUR_3 (CON3.3)
PCIE30_PORT0_IN_REFCLK_N: NVME (R35.2 R40.2), CONNECTEUR_3 (CON3.18)
PCIE30_PORT0_IN_REFCLK_P: NVME (R34.2 R39.2), CONNECTEUR_3 (CON3.16)
PCIE30_PORT0_RX0_N: NVME (J4.41), CONNECTEUR_3 (CON3.6)
PCIE30_PORT0_RX0_P: NVME (J4.43), CONNECTEUR_3 (CON3.4)
PCIE30_PORT0_RX1_N: NVME (J4.29), CONNECTEUR_3 (CON3.12)
PCIE30_PORT0_RX1_P: NVME (J4.31), CONNECTEUR_3 (CON3.10)
PCIE30_PORT0_TX0_N: NVME (J4.47), CONNECTEUR_3 (CON3.24)
PCIE30_PORT0_TX0_P: NVME (J4.49), CONNECTEUR_3 (CON3.22)
PCIE30_PORT0_TX1_N: NVME (J4.35), CONNECTEUR_3 (CON3.30)
PCIE30_PORT0_TX1_P: NVME (J4.37), CONNECTEUR_3 (CON3.28)
PCIE30_PORT1_IN_REFCLK_N: NVME (R33.2 R38.2), CONNECTEUR_3 (CON3.60)
PCIE30_PORT1_IN_REFCLK_P: NVME (R32.2 R37.1), CONNECTEUR_3 (CON3.58)
PCIE30_PORT1_RX2_N: NVME (J4.17), CONNECTEUR_3 (CON3.36)
PCIE30_PORT1_RX2_P: NVME (J4.19), CONNECTEUR_3 (CON3.34)
PCIE30_PORT1_RX3_N: NVME (J4.5), CONNECTEUR_3 (CON3.42)
PCIE30_PORT1_RX3_P: NVME (J4.7), CONNECTEUR_3 (CON3.40)
PCIE30_PORT1_TX2_N: NVME (J4.23), CONNECTEUR_3 (CON3.48)
PCIE30_PORT1_TX2_P: NVME (J4.25), CONNECTEUR_3 (CON3.46)
PCIE30_PORT1_TX3_N: NVME (J4.11), CONNECTEUR_3 (CON3.54)
PCIE30_PORT1_TX3_P: NVME (J4.13), CONNECTEUR_3 (CON3.52)
PMIC_EXT_EN_OUT: POWER_PCie (R95.1 R100.1), Power (R81.1 R86.1), CONNECTEUR_1 (CON1.19)
PWR1: USB2_0 (BR2.1 IC18.6 IC18.8 IC19.8), USB2_0_Connector (6 pins)
PWR2: USB2_0 (BR3.1 IC19.5), USB2_0_Connector (6 pins)
PWR3: USB2_0 (BR5.1 IC20.8), USB2_0_Connector (6 pins)
PWR4: USB2_0 (BR4.1 IC20.5), USB2_0_Connector (6 pins)
PWRON_L: SystemCTL (C41.1 R70.1), CONNECTEUR_1 (CON1.17)
RECOVERY: SystemCTL (C44.1 R73.1), CONNECTEUR_2 (CON2.1)
RESET_L: SystemCTL (C42.1 R71.1), CONNECTEUR_1 (CON1.16)
RRX1_N: USBC_B (J3.B10), CONNECTEUR_2 (CON2.97)
RRX1_P: USBC_B (J3.B11), CONNECTEUR_2 (CON2.95)
RRX2_N: USBC_B (J3.A10), CONNECTEUR_2 (CON2.85)
RRX2_P: USBC_B (J3.A11), CONNECTEUR_2 (CON2.83)
RX1_N: USBC_A (J2.B10), CONNECTEUR_2 (CON2.73)
RX1_P: USBC_A (J2.B11), CONNECTEUR_2 (CON2.71)
RX2_N: USBC_A (J2.A10), CONNECTEUR_2 (CON2.61)
RX2_P: USBC_A (J2.A11), CONNECTEUR_2 (CON2.59)
SCL: USBC_A (R4.2 U3.6), CONNECTEUR_3 (CON3.96)
SCL: USBC_B (R11.2 U9.6), CONNECTEUR_2 (CON2.7)
SD_CLK: SDCARD (J7.5), CONNECTEUR_4 (CON4.60)
SDA: USBC_A (R5.2 U3.7), CONNECTEUR_3 (CON3.98)
SDA: USBC_B (R12.2 U9.7), CONNECTEUR_2 (CON2.5)
SDMMC0_CMD: SDCARD (R46.1), CONNECTEUR_4 (CON4.56)
SDMMC0_D0: SDCARD (R47.1), CONNECTEUR_4 (CON4.64)
SDMMC0_D1: SDCARD (R48.1), CONNECTEUR_4 (CON4.66)
SDMMC0_D2: SDCARD (R44.1), CONNECTEUR_4 (CON4.52)
SDMMC0_D3: SDCARD (R45.1), CONNECTEUR_4 (CON4.54)
TTX1_N: USBC_B (J3.A3), CONNECTEUR_2 (CON2.91)
TTX1_P: USBC_B (J3.A2), CONNECTEUR_2 (CON2.89)
TTX2_N: USBC_B (J3.B3), CONNECTEUR_2 (CON2.79)
TTX2_P: USBC_B (J3.B2), CONNECTEUR_2 (CON2.77)
TX1_N: USBC_A (J2.A3), CONNECTEUR_2 (CON2.67)
TX1_P: USBC_A (J2.A2), CONNECTEUR_2 (CON2.65)
TX2_N: USBC_A (J2.B3), CONNECTEUR_2 (CON2.55)
TX2_P: USBC_A (J2.B2), CONNECTEUR_2 (CON2.53)
TYPEC0_OTG_N: USBC_A (L1.3), CONNECTEUR_2 (CON2.92)
TYPEC0_OTG_P: USBC_A (L1.4), CONNECTEUR_2 (CON2.90)
TYPEC1_OTG_D_N: USBC_B (L2.3), CONNECTEUR_2 (CON2.98)
TYPEC1_OTG_D_P: USBC_B (L2.4), CONNECTEUR_2 (CON2.96)
UART2_RX_M0_DEBUG: SystemCTL (D3.2 R77.1), CONNECTEUR_1 (CON1.22)
UART2_TX_M0_DEBUG: SystemCTL (R78.1), CONNECTEUR_1 (CON1.20)
USB20_HOST1_D_N: WIFI (J5.5), CONNECTEUR_4 (CON4.18)
USB20_HOST1_D_P: WIFI (J5.3), CONNECTEUR_4 (CON4.16)
usb_N: CONNECTEUR_4 (CON4.24), USB2_0 (BR1.4 L19.3)
usb_P: CONNECTEUR_4 (CON4.22), USB2_0 (BR1.2 L19.4)
VBAT_RTC: SystemCTL (RTC-BAT.1), CONNECTEUR_3 (CON3.100)
VDC_MODE: SystemCTL (R74.2), CONNECTEUR_1 (CON1.18)